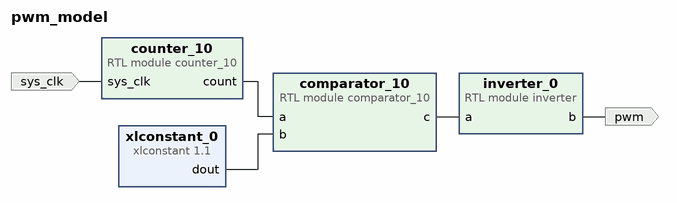
[diagram p0: block diagram of the top level]
# Vivado block design pwm_model, xc7z020clg400-1, Vivado 2019.1
create_bd_design pwm_model

create_bd_port -dir I -type clk sys_clk
create_bd_port -dir O pwm

create_bd_cell -type module -reference comparator_10 comparator_10
create_bd_cell -type ip -vlnv xilinx.com:ip:xlconstant:1.1 xlconstant_0
set_property -dict {CONFIG.CONST_VAL 900 CONFIG.CONST_WIDTH 10} [get_bd_cells xlconstant_0]
create_bd_cell -type module -reference counter_10 counter_10
create_bd_cell -type module -reference inverter inverter_0

# ---- connections ----

connect_bd_net -net sys_clk_0_1 [get_bd_ports sys_clk] [get_bd_pins counter_10/sys_clk]
connect_bd_net -net counter_10_0_count [get_bd_pins counter_10/count] [get_bd_pins comparator_10/a]
connect_bd_net [get_bd_pins xlconstant_0/dout] [get_bd_pins comparator_10/b]
connect_bd_net [get_bd_pins comparator_10/c] [get_bd_pins inverter_0/a]
connect_bd_net -net inverter_0_output [get_bd_pins inverter_0/b] [get_bd_ports pwm]

validate_bd_design
save_bd_design
